# Altium schematic sheet MCU.SchDoc: MCU
size A3; Project: STM32L073Z-EVAL; PageSetup: Record=PageOptions|CenterHorizontal=True|CenterVertical=True|PrintScale=1.00|XCorrection=1.00|YCorrection=1.00|PrintKind=1|BorderSize=5000000|LeftOffset=0|BottomOffset=0|Orientation=2|PaperLength=1000|PaperWidth=1000|Scale=100|PaperSource=7|PrintQuality=-4|MediaType=1|DitherType=10|PaperKind=A3|PrintScaleMode=1; Date: Not used; ApprovedBy: Not used; CheckedBy: Not used; Author: Not used; CompanyName: STMicroelectronics; DrawnBy: Not used; Engineer: Not used; Organization: Not used; Address1: Not used; Address2: Not used; Address3: Not used; Address4: Not used; DocumentNumber: 2; Revision: Not used; SheetNumber: 3; SheetTotal: 13; CurrentTime: Not used; CurrentDate: Not used; Time: Not used; DocumentFullPathAndName: Not used; DocumentName: Not used; ModifiedDate: Not used; ImagePath: Not used; ProjectName: Not used; Application_BuildNumber: Not used
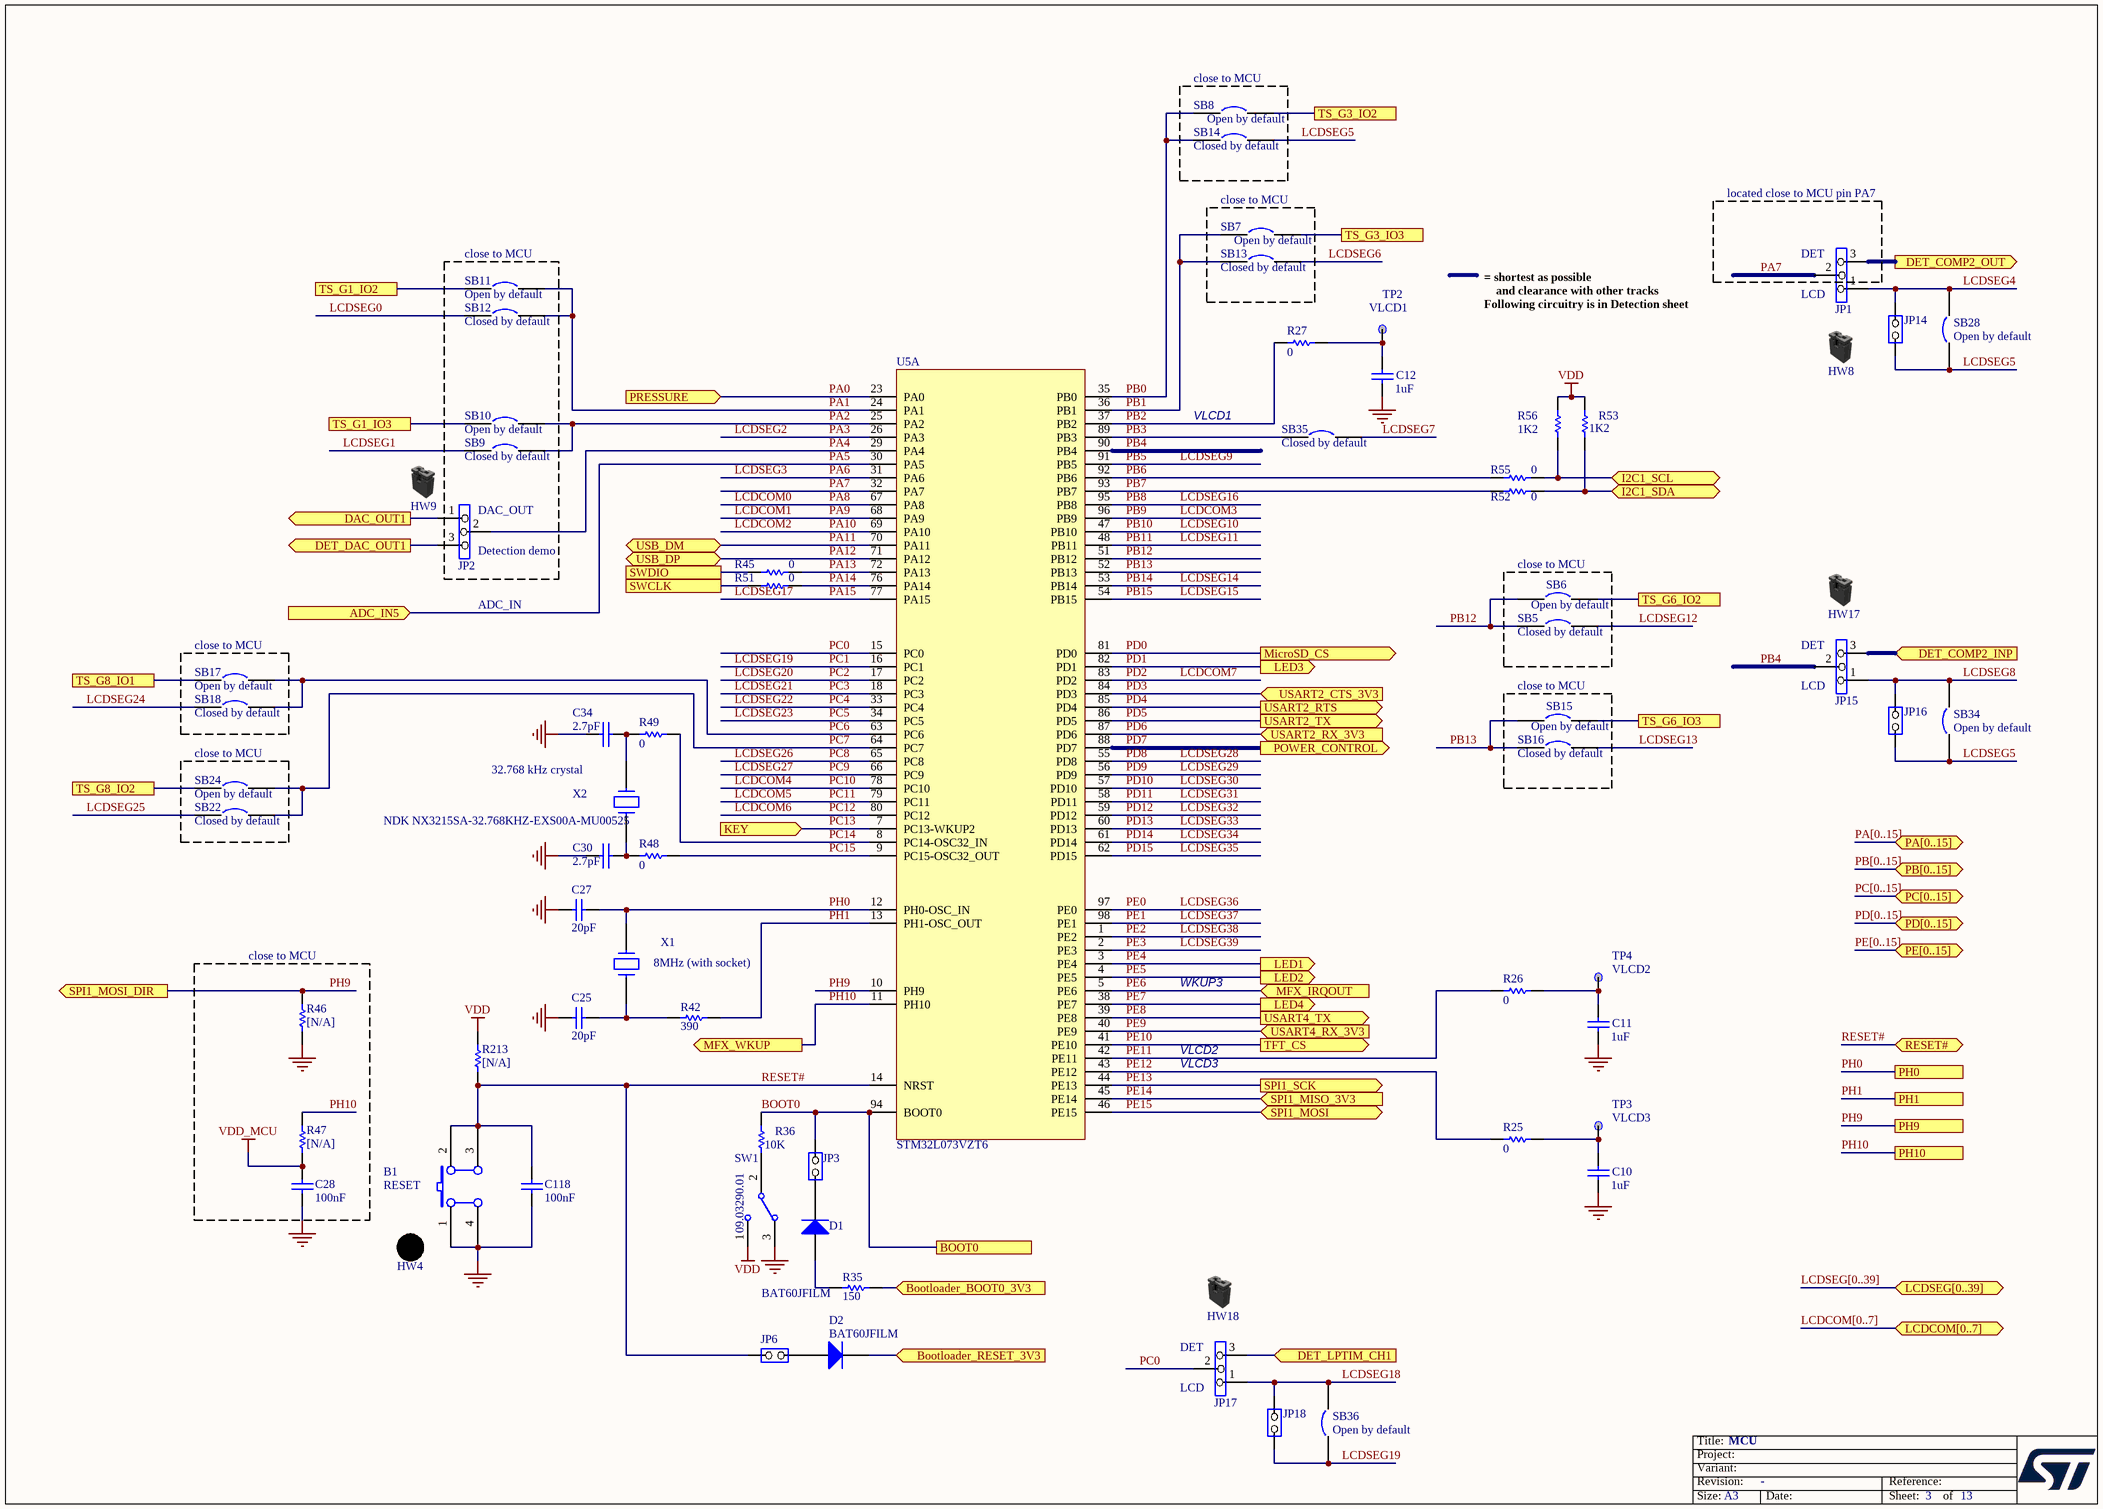
[diagram p0: MCU.SchDoc]

## Parts
B1  RESET  [PB10]
C10  1uF  [0603C]
C11  1uF  [0603C]
C12  1uF  [0603C]
C25  20pF  [0402C]
C27  20pF  [0402C]
C28  100nF  [0402C]
C30  2.7pF  [0603C]
C34  2.7pF  [0603C]
C118  100nF  [0402C]
D1  BAT60JFILM  [SOD-323]
D2  BAT60JFILM  [SOD-323]
HW4  BUTTON_HAT_BLACK  (value not drawn)  (mechanical)
HW8  Shunt Black 2.54mm  (value not drawn)  (mechanical)
HW9  Shunt Black 2.54mm  (value not drawn)  (mechanical)
HW17  Shunt Black 2.54mm  (value not drawn)  (mechanical)
HW18  Shunt Black 2.54mm  (value not drawn)  (mechanical)
JP1  (no value)  [SIP3]
JP2  (no value)  [SIP3]
JP3  (no value)  [SIP2]
JP6  (no value)  [SIP2]
JP14  (no value)  [SIP2]
JP15  (no value)  [SIP3]
JP16  (no value)  [SIP2]
JP17  (no value)  [SIP3]
JP18  (no value)  [SIP2]
R25  0  [0603R]
R26  0  [0603R]
R27  0  [0603R]
R35  150  [0402R]
R36  10K  [0402R]
R42  390  [0603R]
R45  0  [0603R]
R46  [N/A]  [0603R]
R47  [N/A]  [0603R]
R48  0  [0603R]
R49  0  [0603R]
R51  0  [0603R]
R52  0  [0603R]
R53  1K2  [0603R]
R55  0  [0603R]
R56  1K2  [0603R]
R213  [N/A]  [0603R]
SB5  Closed by default  [SB_0603]
SB6  Open by default  [SB_0603]
SB7  Open by default  [SB_0603]
SB8  Open by default  [SB_0603]
SB9  Closed by default  [SB_0603]
SB10  Open by default  [SB_0603]
SB11  Open by default  [SB_0603]
SB12  Closed by default  [SB_0603]
SB13  Closed by default  [SB_0603]
SB14  Closed by default  [SB_0603]
SB15  Open by default  [SB_0603]
SB16  Closed by default  [SB_0603]
SB17  Open by default  [SB_0603]
SB18  Closed by default  [SB_0603]
SB22  Closed by default  [SB_0603]
SB24  Open by default  [SB_0603]
SB28  Open by default  [SB_0603]
SB34  Open by default  [SB_0603]
SB35  Closed by default  [SB_0603]
SB36  Open by default  [SB_0603]
SW1  09.03290.01  [SW1_3TH_2R54_10X2R5]
TP2  Silkscreen: VLCD1  [TP]  (hidden comment: TP)
TP3  Silkscreen: VLCD3  [TP]  (hidden comment: TP)
TP4  Silkscreen: VLCD2  [TP]  (hidden comment: TP)
U5  STM32L073VZT6  [IC149_100_025_B5]  (part A of 2)
X1  8MHz (with socket)  [XTAL_SOCKET]
X2  NDK NX3215SA-32.768KHZ-EXS00A-MU00525  [XTAL_2SM_3R2X1R5]

## Blocks framed on the sheet
close to MCU: SB8 SB14
close to MCU: SB7 SB13
close to MCU: SB5 SB6
close to MCU: SB17 SB18
close to MCU: SB15 SB16
close to MCU: SB22 SB24
close to MCU: C28 R46 R47

## Ports
ADC_IN5 (in), BOOT0, Bootloader_BOOT0_3V3 (in), Bootloader_RESET_3V3 (in), DAC_OUT1 (out), DET_COMP2_INP (in), DET_COMP2_OUT (out), DET_DAC_OUT1 (out), DET_LPTIM_CH1 (in), I2C1_SCL (bidir), I2C1_SDA (bidir), KEY (in), LCDCOM[0..7] (bidir), LCDSEG[0..39] (bidir), LED1 (out), LED2 (out), LED3 (out), LED4 (out), MFX_IRQOUT (in), MFX_WKUP (out), MicroSD_CS (out), PA[0..15] (bidir), PB[0..15] (bidir), PC[0..15] (bidir), PD[0..15] (bidir), PE[0..15] (bidir), PH0, PH1, PH9, PH10, POWER_CONTROL (out), PRESSURE (in), RESET# (bidir), SPI1_MISO_3V3 (in), SPI1_MOSI (bidir), SPI1_MOSI_DIR (out), SPI1_SCK (out), SWCLK, SWDIO, TFT_CS (out), TS_G1_IO2, TS_G1_IO3, TS_G3_IO2, TS_G3_IO3, TS_G6_IO2, TS_G6_IO3, TS_G8_IO1, TS_G8_IO2, USART2_CTS_3V3 (in), USART2_RTS (out), USART2_RX_3V3 (in), USART2_TX (out), USART4_RX_3V3 (in), USART4_TX (out), USB_DM (bidir), USB_DP (bidir)

## Nets
GND: B1.1(A0) B1.4(A1) C10.1 C11.1 C12.1 C25.2 C27.2 C28.1 C30.2 C34.2 C118.1 R46.1 SW1.3
VDD: R53.2 R56.2 R213.2 SW1.1
VDD_MCU: C28.2 R47.1
BOOT0: JP3.1(COMMON) R36.1 U5.94(BOOT0) ; port BOOT0
Bootloader_BOOT0_3V3: R35.2 ; port Bootloader_BOOT0_3V3
Bootloader_RESET_3V3: D2.2(K) ; port Bootloader_RESET_3V3
DAC_OUT1: JP2.1 ; port DAC_OUT1
DET_COMP2_INP: JP15.3 ; port DET_COMP2_INP
DET_COMP2_OUT: JP1.3 ; port DET_COMP2_OUT
DET_DAC_OUT1: JP2.3 ; port DET_DAC_OUT1
DET_LPTIM_CH1: JP17.3 ; port DET_LPTIM_CH1
I2C1_SCL: R55.2 R56.1 ; port I2C1_SCL
I2C1_SDA: R52.2 R53.1 ; port I2C1_SDA
LCDCOM0: U5.67(PA8)  [also labelled PA8]
LCDCOM1: U5.68(PA9)  [also labelled PA9]
LCDCOM2: U5.69(PA10)  [also labelled PA10]
LCDCOM3: U5.96(PB9)  [also labelled PB9]
LCDCOM4: U5.78(PC10)  [also labelled PC10]
LCDCOM5: U5.79(PC11)  [also labelled PC11]
LCDCOM6: U5.80(PC12)  [also labelled PC12]
LCDCOM7: U5.83(PD2)  [also labelled PD2]
LCDSEG0: SB12.1
LCDSEG1: SB9.1
LCDSEG2: U5.26(PA3)  [also labelled PA3]
LCDSEG3: U5.31(PA6)  [also labelled PA6]
LCDSEG4: JP1.1 JP14.2(NO) SB28.2
LCDSEG5: JP14.1(COMMON) JP16.1(COMMON) SB14.2 SB28.1 SB34.1
LCDSEG6: SB13.2
LCDSEG7: SB35.2
LCDSEG8: JP15.1 JP16.2(NO) SB34.2
LCDSEG9: U5.91(PB5)  [also labelled PB5]
LCDSEG10: U5.47(PB10)  [also labelled PB10]
LCDSEG11: U5.48(PB11)  [also labelled PB11]
LCDSEG12: SB5.2
LCDSEG13: SB16.2
LCDSEG14: U5.53(PB14)  [also labelled PB14]
LCDSEG15: U5.54(PB15)  [also labelled PB15]
LCDSEG16: U5.95(PB8)  [also labelled PB8]
LCDSEG17: U5.77(PA15)  [also labelled PA15]
LCDSEG18: JP17.1 JP18.2(NO) SB36.2
LCDSEG19: JP18.1(COMMON) SB36.1 U5.16(PC1)  [also labelled PC1]
LCDSEG20: U5.17(PC2)  [also labelled PC2]
LCDSEG21: U5.18(PC3)  [also labelled PC3]
LCDSEG22: U5.33(PC4)  [also labelled PC4]
LCDSEG23: U5.34(PC5)  [also labelled PC5]
LCDSEG24: SB18.1
LCDSEG25: SB22.1
LCDSEG26: U5.65(PC8)  [also labelled PC8]
LCDSEG27: U5.66(PC9)  [also labelled PC9]
LCDSEG28: U5.55(PD8)  [also labelled PD8]
LCDSEG29: U5.56(PD9)  [also labelled PD9]
LCDSEG30: U5.57(PD10)  [also labelled PD10]
LCDSEG31: U5.58(PD11)  [also labelled PD11]
LCDSEG32: U5.59(PD12)  [also labelled PD12]
LCDSEG33: U5.60(PD13)  [also labelled PD13]
LCDSEG34: U5.61(PD14)  [also labelled PD14]
LCDSEG35: U5.62(PD15)  [also labelled PD15]
LCDSEG36: U5.97(PE0)  [also labelled PE0]
LCDSEG37: U5.98(PE1)  [also labelled PE1]
LCDSEG38: U5.1(PE2)  [also labelled PE2]
LCDSEG39: U5.2(PE3)  [also labelled PE3]
PA0: U5.23(PA0) ; port PRESSURE
PA1: SB11.2 SB12.2 U5.24(PA1)
PA2: SB9.2 SB10.2 U5.25(PA2)
PA4: JP2.2 U5.29(PA4)
PA5: U5.30(PA5) ; port ADC_IN5
PA7: JP1.2 U5.32(PA7)
PA11: U5.70(PA11) ; port USB_DM
PA12: U5.71(PA12) ; port USB_DP
PA13: R45.2 U5.72(PA13)
PA14: R51.2 U5.76(PA14)
PB0: SB8.1 SB14.1 U5.35(PB0)
PB1: SB7.1 SB13.1 U5.36(PB1)
PB2: R27.1 U5.37(PB2)
PB3: SB35.1 U5.89(PB3)
PB4: JP15.2 U5.90(PB4)
PB6: R55.1 U5.92(PB6)
PB7: R52.1 U5.93(PB7)
PB12: SB5.1 SB6.1 U5.51(PB12)
PB13: SB15.1 SB16.1 U5.52(PB13)
PC0: JP17.2 U5.15(PC0)
PC6: SB17.2 SB18.2 U5.63(PC6)
PC7: SB22.2 SB24.2 U5.64(PC7)
PC13: U5.7(PC13-WKUP2) ; port KEY
PC14: R49.2 U5.8(PC14-OSC32_IN)
PC15: R48.2 U5.9(PC15-OSC32_OUT)
PD0: U5.81(PD0) ; port MicroSD_CS
PD1: U5.82(PD1) ; port LED3
PD3: U5.84(PD3) ; port USART2_CTS_3V3
PD4: U5.85(PD4) ; port USART2_RTS
PD5: U5.86(PD5) ; port USART2_TX
PD6: U5.87(PD6) ; port USART2_RX_3V3
PD7: U5.88(PD7) ; port POWER_CONTROL
PE4: U5.3(PE4) ; port LED1
PE5: U5.4(PE5) ; port LED2
PE6: U5.5(PE6) ; port MFX_IRQOUT
PE7: U5.38(PE7) ; port LED4
PE8: U5.39(PE8) ; port USART4_TX
PE9: U5.40(PE9) ; port USART4_RX_3V3
PE10: U5.41(PE10) ; port TFT_CS
PE11: R26.1 U5.42(PE11)
PE12: R25.1 U5.43(PE12)
PE13: U5.44(PE13) ; port SPI1_SCK
PE14: U5.45(PE14) ; port SPI1_MISO_3V3
PE15: U5.46(PE15) ; port SPI1_MOSI
PH0: C27.1 U5.12(PH0-OSC_IN) X1.2 ; port PH0
PH1: R42.1 U5.13(PH1-OSC_OUT) ; port PH1
PH9: R46.2 U5.10(PH9) ; port SPI1_MOSI_DIR, port PH9
PH10: R47.2 U5.11(PH10) ; port PH10, port MFX_WKUP
RESET#: B1.2(B0) B1.3(B1) C118.2 JP6.1(COMMON) R213.1 U5.14(NRST) ; port RESET#
SWCLK: R51.1 ; port SWCLK
SWDIO: R45.1 ; port SWDIO
TS_G1_IO2: SB11.1 ; port TS_G1_IO2
TS_G1_IO3: SB10.1 ; port TS_G1_IO3
TS_G3_IO2: SB8.2 ; port TS_G3_IO2
TS_G3_IO3: SB7.2 ; port TS_G3_IO3
TS_G6_IO2: SB6.2 ; port TS_G6_IO2
TS_G6_IO3: SB15.2 ; port TS_G6_IO3
TS_G8_IO1: SB17.1 ; port TS_G8_IO1
TS_G8_IO2: SB24.1 ; port TS_G8_IO2
NetC10_2: C10.2 R25.2 TP3.1
NetC11_2: C11.2 R26.2 TP4.1
NetC12_2: C12.2 R27.2 TP2.1
NetC25_1: C25.1 R42.2 X1.1
NetC30_1: C30.1 R48.1 X2.1
NetC34_1: C34.1 R49.1 X2.2
NetD1_1: D1.1(A) R35.1
NetD1_2: D1.2(K) JP3.2(NO)
NetD2_1: D2.1(A) JP6.2(NO)
NetR36_2: R36.2 SW1.2

## Buses and harness runs
bus LCDCOM[0..7] = port LCDCOM[0..7]
bus LCDSEG[0..39] = port LCDSEG[0..39]
bus PA[0..15] = port PA[0..15]
bus PB[0..15] = port PB[0..15]
bus PC[0..15] = port PC[0..15]
bus PD[0..15] = port PD[0..15]
bus PE[0..15] = port PE[0..15]

## Notes on the sheet
- located close to MCU pin PA7
- (near SB11) close to MCU
- LCD
- (near JP1) DET
- VLCD1
- (near JP2) DAC_OUT
- (near JP2) Detection demo
- ADC_IN
- (near JP15) DET
- (near JP15) LCD
- 32.768 kHz crystal
- WKUP3
- VLCD2
- VLCD3
- (near JP17) LCD
- (near JP17) DET
- Title:
- Project:
- Size:
- Revision:
- Variant:
- A3
- -
- Date:
- Reference:
- Sheet:
- of

## Library data of the parts
B1 = SW PUSHBUTTON: SE PUSHBUTTON; Ordered by: Subcon; Comments: no comment; Assembly: Black; Silkscreen: Reset; ECCN_US/EU: n/a
C10-C12 = CAP: Capacitor; Value: 100nF; Ordered by: Subcon; Published: 8-Jun-2000; Revision: July-2002: Re-released for DXP Platform.; Publisher: Altium Limited; ECCN_US/EU: n/a
C25 C27 C28 C118 = CAP: Capacitor; Value: 100pF; Ordered by: Subcon; Published: 8-Jun-2000; Revision: July-2002: Re-released for DXP Platform.; Publisher: Altium Limited; ECCN_US/EU: n/a
C30 C34 = CAP: Capacitor; Ordered by: Subcon; ECCN_US/EU: n/a
D1 D2 = Diode: Default Diode; Code - JEDEC: DO-214-AB; Ordered by: ST; ECCN_US/EU: EAR99/NEC; Ref St: 9151097; Published: 8-Jun-2000; Revision: July-2002: Re-released for DXP Platform.; Publisher: Altium Limited; Manuf_1: ST; Manuf_Part_1: BAT60JFILM
JP1 JP15 JP17 = Jumper3: Ordered by: Subcon; Silkscreen: 1,2: LCD / 2,3: DET; Assembly: 1-2 closed (LCD); ECCN_US/EU: n/a
JP2 = Jumper3: Ordered by: Subcon; Silkscreen: 1,2: DAC_OUT / 2,3: Det; Assembly: 1-2 closed (DAC); ECCN_US/EU: n/a
JP3 = JP2: Ordered by: Subcon; Silkscreen: BL_Boot0; Assembly: opened; ECCN_US/EU: n/a
JP6 = JP2: Ordered by: Subcon; Silkscreen: BL_RST; Assembly: opened; ECCN_US/EU: n/a
JP14 JP16 JP18 = JP2: Ordered by: Subcon; Assembly: opened; ECCN_US/EU: n/a
R25-R27 R42 R45 R48 R49 R51-R53 R55 R56 = Res1: Resistor; Value: 1K; Ordered by: Subcon; Published: 8-Jun-2000; Revision: July-2002: Re-released for DXP Platform.; Publisher: Altium Limited; ECCN_US/EU: n/a
R35 R36 = res1: Resistor; Value: 1K; Ordered by: Subcon; Published: 8-Jun-2000; Revision: July-2002: Re-released for DXP Platform.; Publisher: Altium Limited; ECCN_US/EU: n/a
R46 R47 R213 = res1: Resistor; Value: 1K; Ordered by: Subcon; Fitted: NO; Published: 8-Jun-2000; Revision: July-2002: Re-released for DXP Platform.; Publisher: Altium Limited; ECCN_US/EU: n/a
SB5 SB9 SB12-SB14 SB16 SB18 SB22 SB35 = Circuit Breaker: Ordered by: Subcon; Comments: Solder bridge; Published: 24-Mar-1999; Revision: July-2002: Re-released for DXP Platform.; Publisher: Altium Limited; ECCN_US/EU: n/a
SB6-SB8 SB10 SB11 SB15 SB17 SB24 SB28 SB34 SB36 = Circuit Breaker: Ordered by: Subcon; Comments: Solder bridge; Fitted: NO; Published: 24-Mar-1999; Revision: July-2002: Re-released for DXP Platform.; Publisher: Altium Limited; ECCN_US/EU: n/a
SW1 = SW-SPDT: SPDT Subminiature Toggle Switch, Right Angle Mounting, Vertical Actuation; Revision 1: Jul-2002: Re-released for DXP Platform.; Revision 2: 17-Dec-2003: Schematic revised, PCB Footprint replaced.; Ordered by: Subcon; Silkscreen: 0 <--> 1   0=Flash, 1 = Sys mem; Published: 24-Mar-1999; Datasheet: Latest Revision: 05-Dec-2000; Publisher: Altium Limited; ECCN_US/EU: n/a
TP2-TP4 = TP: Ordered by: Subcon; Fitted: NO; ECCN_US/EU: n/a
U5 = BigNemo: Manuf_Part_1: FG=32L073VZT6$x3 cut 2.0 marking "B"; Ordered by: ST; ECCN_US/EU: 3A991A2/NEC; Ref St: 9175165; Manuf_1: ST
X1 = CRYSTAL: Ordered by: Subcon; Assembly: with socket; ECCN_US/EU: n/a
X2 = CRYSTAL_32K: Crystal; Ordered by: Subcon; Manuf_1: NDK; Manuf_Part_1: NX3215SA-32.768KHZ-EXS00A-MU00525; ECCN_US/EU: n/a